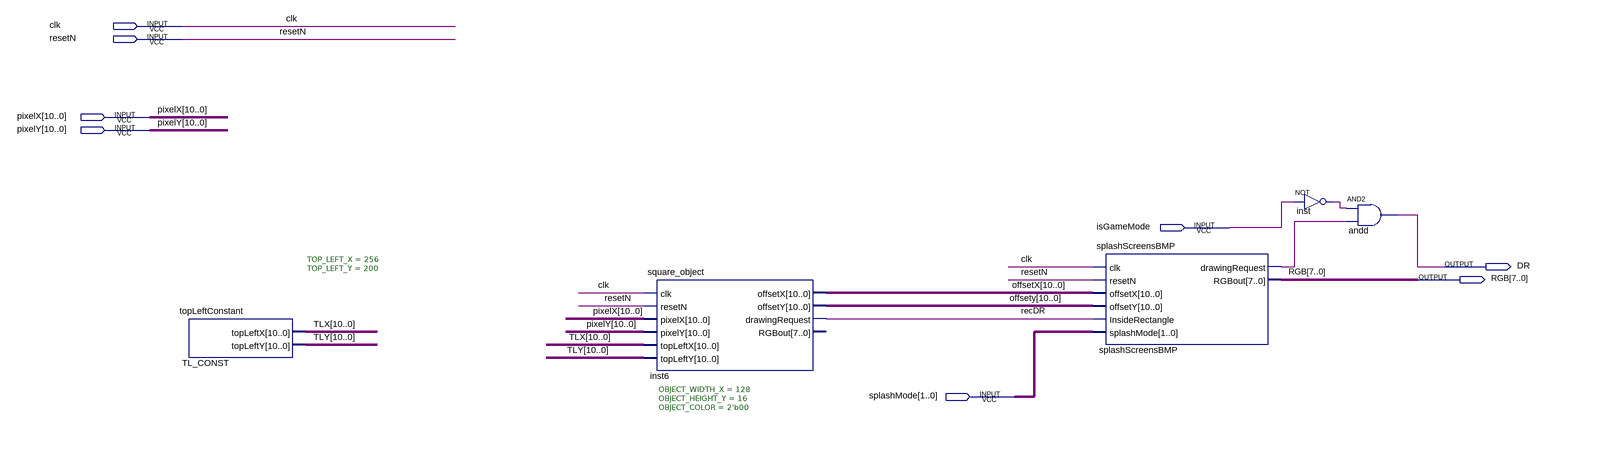
[diagram p0: schematic sheet]
// Quartus schematic splashScreens.bdf as structural Verilog: 5 symbols, 8 pins
module splashScreens (
  input  clk,
  input  resetN,
  input  [10:0] pixelX,
  input  [10:0] pixelY,
  input  isGameMode,
  input  [1:0] splashMode,
  output DR,
  output [7:0] RGB
);

  wire inst_out, recDR, splashScreensBMP_drawingrequest;
  wire [10:0] offsetX, offsety, TLX, TLY;

  topLeftConstant #(.TOP_LEFT_X(256), .TOP_LEFT_Y(200)) TL_CONST (.topLeftX(TLX), .topLeftY(TLY));
  square_object #(.OBJECT_WIDTH_X(128), .OBJECT_HEIGHT_Y(16), .OBJECT_COLOR(2'b00)) inst6 (
    .clk(clk), .resetN(resetN), .pixelX(pixelX), .pixelY(pixelY), .topLeftX(TLX), .topLeftY(TLY),
    .offsetX(offsetX), .offsetY(offsety), .drawingRequest(recDR));  // open: RGBout
  splashScreensBMP splashScreensBMP (
    .clk(clk), .resetN(resetN), .offsetX(offsetX), .offsetY(offsety), .InsideRectangle(recDR),
    .splashMode(splashMode), .drawingRequest(splashScreensBMP_drawingrequest), .RGBout(RGB));
  not inst (inst_out, isGameMode);
  and andd (DR, inst_out, splashScreensBMP_drawingrequest);
endmodule
